# Altium schematic sheet 03_Flow.SchDoc: =ProjectTitle
size A3; Organization: Nerdtronix GmbH; Address1: Industriestraße 14a; Address2: D-86438 Kissing; SheetNumber: 3; SheetTotal: 3
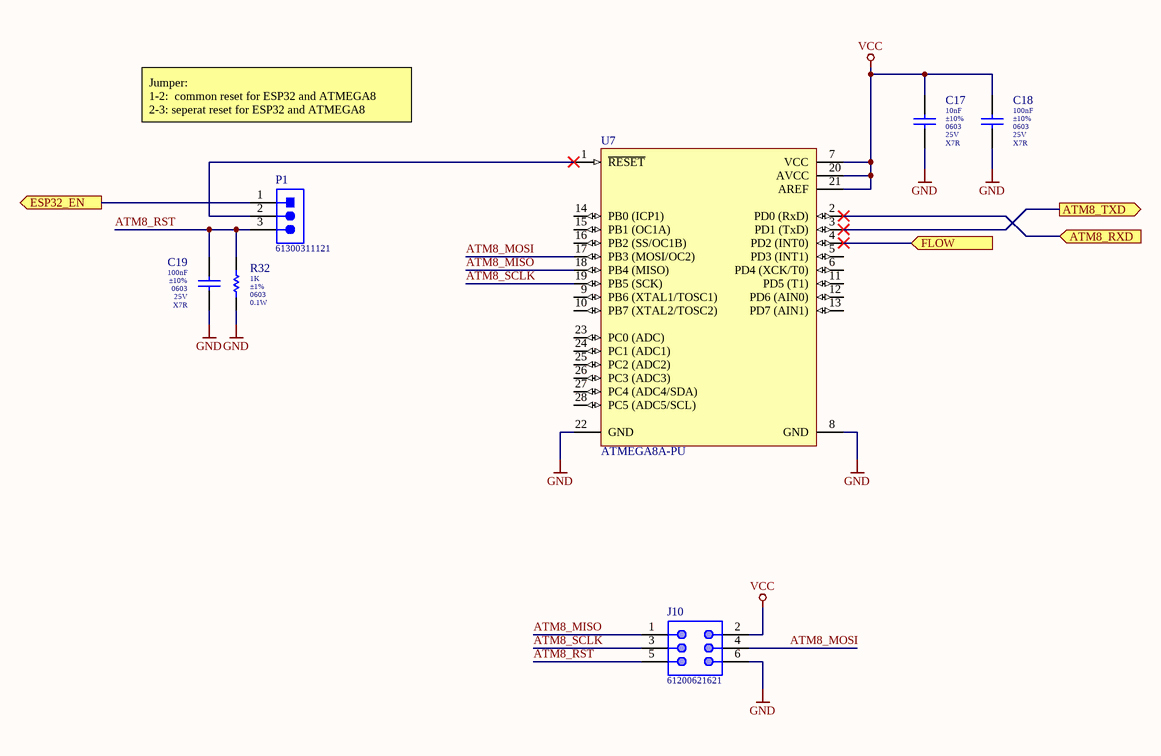
[diagram p0: 03_Flow.SchDoc]

## Parts
C17  value 10nF  Tolerance: ±10%  Package: 0603  Voltage: 25V  Dielectric: X7R  [C_0603_B]  (hidden comment: CL10B103KA8NNNC)
C18  value 100nF  Tolerance: ±10%  Package: 0603  Voltage: 25V  Dielectric: X7R  [C_0603_B]  (hidden comment: CL10B104KA8NNNC)
C19  value 100nF  Tolerance: ±10%  Package: 0603  Voltage: 25V  Dielectric: X7R  [C_0603_B]  (hidden comment: CL10B104KA8NNNC)
J10  61200621621  [61200621621]
P1  61300311121  [61300311121]
R32  value 1K  Package: 0603  Power: 0.1W  Tolerance: ±1%  [R_0603_B]  (hidden comment: RC0603FR-071KL)
U7  ATMEGA8A-PU  [DIP254P762X457-28]

## Ports
ATM8_RXD (in), ATM8_TXD (out), ESP32_EN (out), FLOW (in)

## Nets
GND: C17.1 C18.1 C19.1 J10.6 R32.1 U7.8(GND) U7.22(GND)
VCC: C17.2 C18.2 J10.2 U7.7(VCC) U7.20(AVCC) U7.21(AREF)
ATM8_MISO: J10.1 U7.18(PB4_(MISO))
ATM8_MOSI: J10.4 U7.17(PB3_(MOSI/OC2))
ATM8_RST: C19.2 J10.5 P1.3 R32.2
ATM8_RXD: U7.2(PD0_(RxD)) ; port ATM8_RXD
ATM8_SCLK: J10.3 U7.19(PB5_(SCK))
ATM8_TXD: U7.3(PD1_(TxD)) ; port ATM8_TXD
ESP32_EN: P1.1 ; port ESP32_EN
FLOW: U7.4(PD2_(INT0)) ; port FLOW
NetP1_2: P1.2 U7.1(~{RESET})

Not connected (* = marked no-connect by the designer): U7 5(PD3_(INT1)) 6(PD4_(XCK/T0)) 9(PB6_(XTAL1/TOSC1)) 10(PB7_(XTAL2/TOSC2)) 11(PD5_(T1)) 12(PD6_(AIN0)) 13(PD7_(AIN1)) 14(PB0_(ICP1)) 15(PB1_(OC1A)) 16(PB2_(SS/OC1B)) 23(PC0_(ADC)) 24(PC1_(ADC1)) 25(PC2_(ADC2)) 26(PC3_(ADC3)) 27(PC4_(ADC4/SDA)) 28(PC5_(ADC5/SCL))

## Notes on the sheet
- Jumper:
  1-2:  common reset for ESP32 and ATMEGA8
  2-3: seperat reset for ESP32 and ATMEGA8
- Title
- Size:
- Date:
- A3
- Number:
- Time:
- Revision:
- Sheet
- of
- Author:
- File:

## Library data of the parts
C17 = CMP-001-00194-31: CAP 10nF 25V 0603 ±10% X7R; Manufacturer: Samsung; Pad Count: 2; Packaging: Cut Tape; Manufacturer Part Number: CL10B103KA8NNNC; Mounting Type: SMT; Distributor Ordering Code: 1276-1132-1-ND; Creator: MSt 10-08-21; Distributor: Digikey; Minimum Operating Temperature: -55; Maximum Operating Temperature: 125; RoHS: Yes
C18 C19 = CMP-001-00198-28: CAP 100nF 25V 0603 ±10% X7R; Manufacturer: Samsung; Revision Status: new; Placed: Yes; Pad Count: 2; Maximum Operating Temperature: 125; Distributor Ordering Code: 1276-1006-1-ND; Creator: Mst 10-08-21; Packaging: cut tape; RoHS: yes; Distributor: Digikey; Minimum Operating Temperature: -55; Mounting Type: SMD; Manufacturer Part Number: CL10B104KA8NNNC
J10 = CMP-002-000817-8: 2x3-pos. Boxed Header Male 2.54mm RM THT Straight; Manufacturer: Wuerth Elektronik; Pad Count: 6; Creator: MSt 13-02-22; Design Item ID: 61200621621; RoHS: Yes; Maximum Operating Temperature: 105; Packaging: Tray; Manufacturer Part Number: 61200621621; Distributor Ordering Code: 732-5394-ND; Mounting Type: THT; Distributor: Digikey; Minimum Operating Temperature: -40
P1 = CMP-002-00006-4: 1x3-pos. WR-PHD Pin Header 2.54mm RM THTVertical; Manufacturer: Wurth Elektronik; Pad Count: 3; Packaging: Bag; Manufacturer Part Number: 61300311121; Mounting Type: THT; Maximum Operating Temperature: 105; Design Item ID: 61300311121; Distributor: Digikey; RoHS: Yes; Creator: MSt 18-04-22; Minimum Operating Temperature: -40; Distributor Ordering Code: 732-5316-ND
R32 = CMP-002-004805-43: RES 1K 0603 1% 0.1W; Manufacturer: Yageo; Maximum Voltage: 150V; Pad Count: 2; Mounting Type: SMT; RoHS: Yes; Creator: MSt 26-08-21; Minimum Operating Temperature: -55; Manufacturer Part Number: RC0603FR-071KL; Distributor Ordering Code: 311-1.00KHRCT-ND; Maximum Operating Temperature: 155; Distributor: Digikey; Packaging: Cut Tape
U7 = CMP-002-000816-3: ATMEGA8; Manufacturer: Microchip Technology; Pad Count: 28; Minimum Operating Temperature: -55; Distributor Ordering Code: ATMEGA8A-PU-ND; Creator: MSt 13-02-22; RoHS: Yes; Distributor: Digikey; Mounting Type: THT; Maximum Operating Temperature: 125; Packaging: Tube; Manufacturer Part Number: ATMEGA8A-PU; Source: ATMEGA8A-PU.SchLib; Design Item ID: ATMEGA8A-PU